# Altium schematic sheet Zero_Crossing.SchDoc
size A4; SheetNumber: 6; SheetTotal: 7
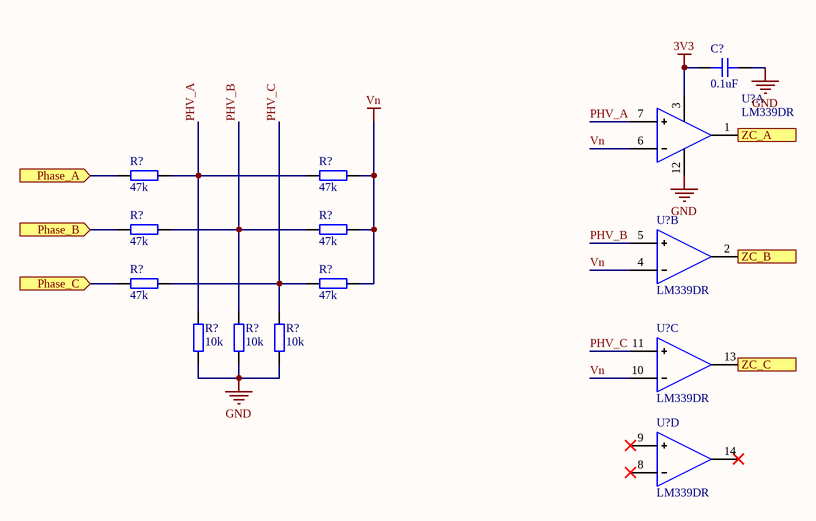
[diagram p0: Zero_Crossing.SchDoc]

## Parts
(Parts that share a designator on the sheet are numbered #1, #2 ... from top to bottom, then left to right.)
C?  0.1uF  [CAP_0402]
R?#1  47k  [RES_0402]
R?#2  47k  [RES_0402]
R?#3  47k  [RES_0402]
R?#4  47k  [RES_0402]
R?#5  47k  [RES_0402]
R?#6  47k  [RES_0402]
R?#7  10k  [RES_0402]
R?#8  10k  [RES_0402]
R?#9  10k  [RES_0402]
U?#1  LM339DR  [LM339DR]  (part A of 4)
U?#2  LM339DR  [LM339DR]  (part B of 4)
U?#3  LM339DR  [LM339DR]  (part C of 4)
U?#4  LM339DR  [LM339DR]  (part D of 4)

## Ports
Phase_A (in), Phase_B (in), Phase_C (in), ZC_A (out), ZC_B (out), ZC_C (out)

## Nets
3V3: C?.2 U?#1.3
GND: C?.1 R?#7.1 R?#8.1 R?#9.1 U?#1.12
Vn: R?#2.2 R?#4.2 R?#6.2 U?#1.6 U?#2.4 U?#3.10
Phase_A: R?#1.1 ; port Phase_A
Phase_B: R?#3.1 ; port Phase_B
Phase_C: R?#5.1 ; port Phase_C
PHV_A: R?#1.2 R?#2.1 R?#7.2 U?#1.7
PHV_B: R?#3.2 R?#4.1 R?#8.2 U?#2.5
PHV_C: R?#5.2 R?#6.1 R?#9.2 U?#3.11
ZC_A: U?#1.1 ; port ZC_A
ZC_B: U?#2.2 ; port ZC_B
ZC_C: U?#3.13 ; port ZC_C

Not connected (* = marked no-connect by the designer): U?#4 8* 9* 14*

## Library data of the parts
C? = CAP_0402: Capacitor SMD 0402; Manufacturer: *; Manufacturer Part Number: *; Distributor Link: *; LCSC: *; Rating: *; Dielectric: *
R?#1-R?#9 = RES_0402: Resistor SMD 0402; Manufacturer: *; Manufacturer Part Number: *; Distributor Link: *; LCSC: *